# Altium project MCH_MAIN.PrjPcb (part 7 of 7)
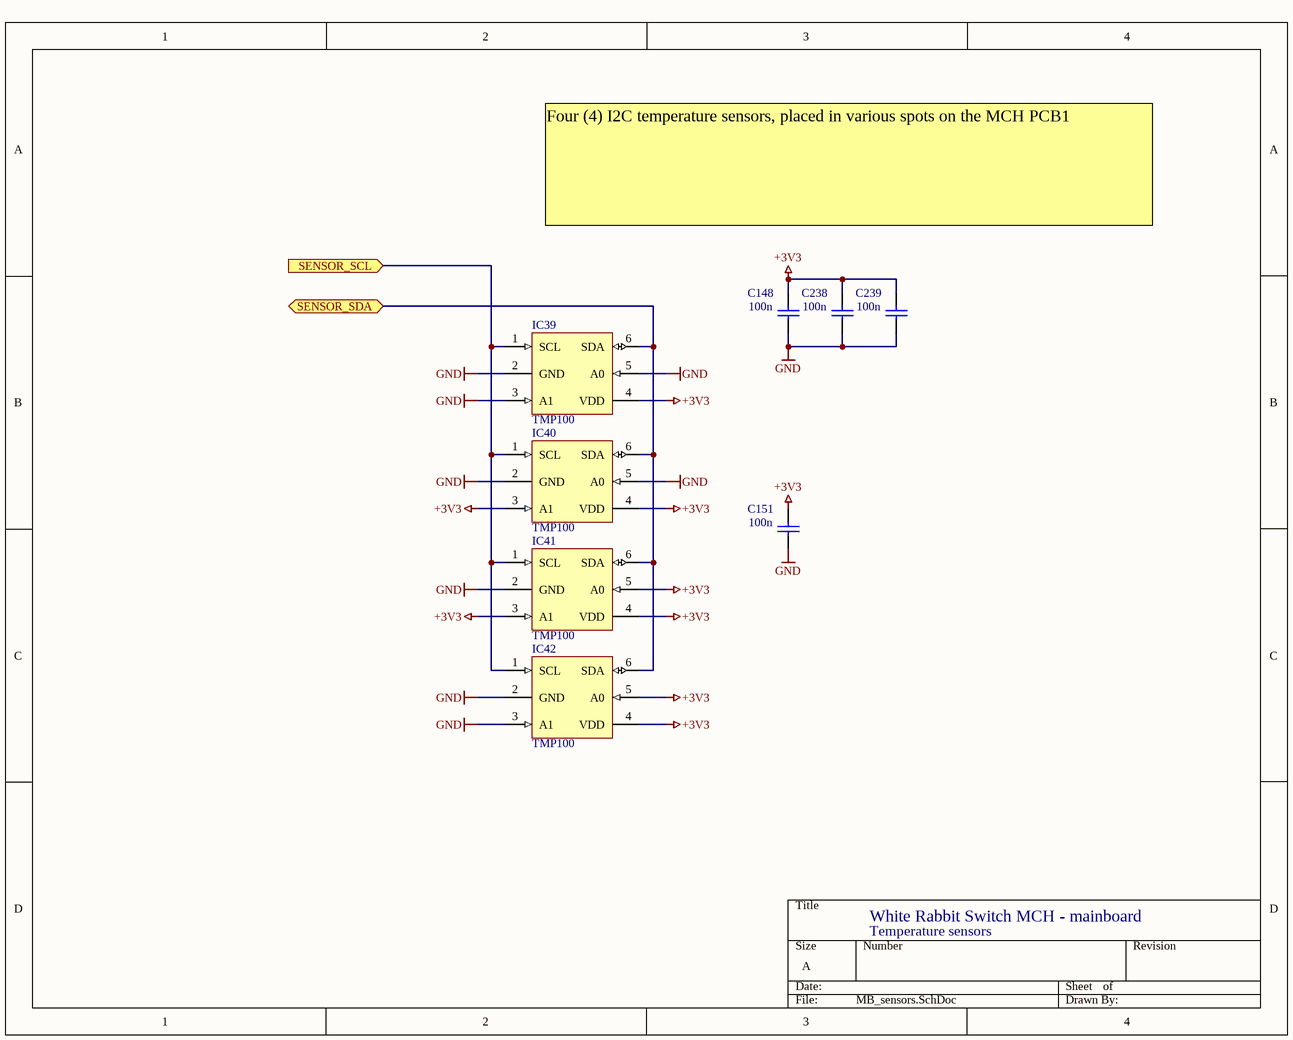
[diagram p20: MB_sensors.SchDoc]

## Nets that join several sheets
+1V2: MB_CPU_io_ports (7 pins), MB_fpga_power (95 pins), MB_power_supply (6 pins), MB_watchdog_mcu (U1.12)
+2V5: MB_main (CN5.9 CN5.10 CN5.11 CN5.12), MB_fpga_power (66 pins), MB_power_supply (17 pins), MB_clocking (IC2.28 IC2.29 L13.2), MB_watchdog_mcu (U1.15)
+2V5_PHY: MB_power_supply (5 pins), DP0 (13 pins), DP1 (13 pins), DP2 (13 pins), DP3 (13 pins), DP4 (13 pins), DP5 (13 pins), DP6 (13 pins), DP7 (13 pins)
+3V3: MB_main (27 pins), MB_CPU_100m_ethernet (18 pins), MB_CPU_io_ports (33 pins), MB_CPU_memory (44 pins), MB_fpga_power (37 pins), MB_power_supply (28 pins), MB_ZBT_memory (28 pins), MB_clocking (C4.2 IC1.8 L14.2), MB_watchdog_mcu (R88.2), MB_sensors (12 pins)
+3V3_MP: MB_main (CN2.4 R75.1), MB_watchdog_mcu (50 pins)
+12V_BACKPLANE: MB_main (8 pins), MB_power_supply (F1.1)
+12V_BULK: MB_main (CN5.1 CN5.2 CN5.3 CN5.4), MB_power_supply (24 pins), MB_watchdog_mcu (R87.2)
ETH100_AGND: MB_main (CN3.8), MB_CPU_100m_ethernet (12 pins)
GND: MB_main (127 pins), MB_CPU_100m_ethernet (18 pins), MB_CPU_io_ports (58 pins), MB_CPU_memory (40 pins), MB_fpga_power (199 pins), MB_power_supply (86 pins), MB_ZBT_memory (27 pins), MB_clocking (16 pins), MB_watchdog_mcu (36 pins), DP0 (14 pins), DP1 (14 pins), DP2 (14 pins), DP3 (14 pins), DP4 (14 pins), DP5 (14 pins), DP6 (14 pins), DP7 (14 pins), MB_sensors (12 pins)
A0: MB_CPU_io_ports (IC5.E9), MB_CPU_memory (IC6.15)
A1: MB_CPU_io_ports (IC5.A9), MB_CPU_memory (IC7.15)
A2: MB_CPU_io_ports (IC5.D9), MB_CPU_memory (IC6.23 IC7.23)
A3: MB_CPU_io_ports (IC5.C9), MB_CPU_memory (IC6.24 IC7.24)
A4: MB_CPU_io_ports (IC5.B9), MB_CPU_memory (IC6.25 IC7.25)
A5: MB_CPU_io_ports (IC5.A8), MB_CPU_memory (IC6.26 IC7.26)
A6: MB_CPU_io_ports (IC5.F9), MB_CPU_memory (IC6.29 IC7.29)
A7: MB_CPU_io_ports (IC5.B8), MB_CPU_memory (IC6.30 IC7.30)
A8: MB_CPU_io_ports (IC5.C8), MB_CPU_memory (IC6.31 IC7.31)
A9: MB_CPU_io_ports (IC5.D8), MB_CPU_memory (IC6.32 IC7.32)
A10: MB_CPU_io_ports (IC5.A7), MB_CPU_memory (IC6.33 IC7.33)
A11: MB_CPU_io_ports (IC5.A6), MB_CPU_memory (IC6.34 IC7.34)
A13: MB_CPU_io_ports (IC5.C7), MB_CPU_memory (IC6.35 IC7.35)
A14: MB_CPU_io_ports (IC5.E7), MB_CPU_memory (IC6.36 IC7.36)
A16: MB_CPU_io_ports (IC5.F7), MB_CPU_memory (IC6.20 IC7.20)
A17: MB_CPU_io_ports (IC5.D6), MB_CPU_memory (IC6.21 IC7.21)
A21: MB_CPU_io_ports (IC5.C6), MB_CPU_memory (IC11.17)
A22: MB_CPU_io_ports (IC5.B6), MB_CPU_memory (IC11.16)
CAS: MB_CPU_io_ports (IC5.B3), MB_CPU_memory (IC6.17 IC7.17)
CLKB_FPGA_DONE: MB_main (CN5.27), MB_CPU_io_ports (IC5.H16)
CLKB_FPGA_nCONF: MB_main (CN5.29), MB_CPU_io_ports (IC5.G15)
CLKB_FPGA_nSTAT: MB_main (CN5.31), MB_CPU_io_ports (IC5.G16)
CLKB_nRST: MB_main (CN4.41), MB_CPU_io_ports (IC5.F15)
CMI_CLKSRC0: MB_main (CN4.19), MB_main_FPGA (IC12.AF26)
CMI_CLKSRC1: MB_main (CN4.17), MB_main_FPGA (IC12.AE25)
CMI_IRQ0: MB_main (CN4.23), MB_main_FPGA (IC12.AF24)
CMI_IRQ1: MB_main (CN4.21), MB_main_FPGA (IC12.AF25)
CMI_PIO0: MB_main (CN4.13), MB_main_FPGA (IC12.AD22)
CMI_PIO1: MB_main (CN4.11), MB_main_FPGA (IC12.AC21)
CMI_PIO2: MB_main (CN4.9), MB_main_FPGA (IC12.AB20)
CMI_PIO3: MB_main (CN4.7), MB_main_FPGA (IC12.AE23)
CMI_SPI_CS: MB_main (CN4.27), MB_main_FPGA (IC12.AE24)
CMI_SPI_SCLK: MB_main (CN4.33), MB_main_FPGA (IC12.AF23)
CMI_SPI_SDIN: MB_main (CN4.31), MB_main_FPGA (IC12.AC22)
CMI_SPI_SDOUT: MB_main (CN4.29), MB_main_FPGA (IC12.AD24)
CONF_DONE: MB_CPU_io_ports (IC5.G18), MB_fpga_power (IC12.P24 R43.2)
CPU_A0: MB_CPU_io_ports (IC5.U6), MB_main_FPGA (IC12.AA24)
CPU_A1: MB_CPU_io_ports (IC5.V5), MB_main_FPGA (IC12.R28)
CPU_A2: MB_CPU_io_ports (IC5.R6), MB_main_FPGA (IC12.J25)
CPU_A3: MB_CPU_io_ports (IC5.V6), MB_main_FPGA (IC12.AA22)
CPU_A4: MB_CPU_io_ports (IC5.P8), MB_main_FPGA (IC12.H24)
CPU_A5: MB_CPU_io_ports (IC5.U7), MB_main_FPGA (IC12.W22)
CPU_A6: MB_CPU_io_ports (IC5.N7), MB_main_FPGA (IC12.M25)
CPU_A7: MB_CPU_io_ports (IC5.T7), MB_main_FPGA (IC12.J24)
CPU_A8: MB_CPU_io_ports (IC5.P7), MB_main_FPGA (IC12.H25)
CPU_A9: MB_CPU_io_ports (IC5.V7), MB_main_FPGA (IC12.AA23)
CPU_A10: MB_CPU_io_ports (IC5.U8), MB_main_FPGA (IC12.U28)
CPU_A11: MB_CPU_io_ports (IC5.N8), MB_main_FPGA (IC12.M26)
CPU_A12: MB_CPU_io_ports (IC5.T8), MB_main_FPGA (IC12.K26)
CPU_A13: MB_CPU_io_ports (IC5.R8), MB_main_FPGA (IC12.L25)
CPU_A14: MB_CPU_io_ports (IC5.R7), MB_main_FPGA (IC12.K25)
CPU_A15: MB_CPU_io_ports (IC5.V8), MB_main_FPGA (IC12.U27)
CPU_A16: MB_CPU_io_ports (IC5.U9), MB_main_FPGA (IC12.V28)
CPU_A17: MB_CPU_io_ports (IC5.R9), MB_main_FPGA (IC12.L24)
CPU_A18: MB_CPU_io_ports (IC5.T9), MB_main_FPGA (IC12.L26)
CPU_A19: MB_CPU_io_ports (IC5.P9), MB_main_FPGA (IC12.G26)
CPU_A20: MB_CPU_io_ports (IC5.V9), MB_main_FPGA (IC12.V27)
CPU_CS: MB_CPU_io_ports (IC5.P10), MB_main_FPGA (IC12.V25)
CPU_D0: MB_CPU_io_ports (IC5.T10), MB_main_FPGA (IC12.P25)
CPU_D1: MB_CPU_io_ports (IC5.R10), MB_main_FPGA (IC12.P26)
CPU_D2: MB_CPU_io_ports (IC5.N10), MB_main_FPGA (IC12.V26)
CPU_D3: MB_CPU_io_ports (IC5.U11), MB_main_FPGA (IC12.AB28)
CPU_D4: MB_CPU_io_ports (IC5.P12), MB_main_FPGA (IC12.W26)
CPU_D5: MB_CPU_io_ports (IC5.V11), MB_main_FPGA (IC12.AA26)
CPU_D6: MB_CPU_io_ports (IC5.N11), MB_main_FPGA (IC12.W25)
CPU_D7: MB_CPU_io_ports (IC5.T11), MB_main_FPGA (IC12.R24)
CPU_D8: MB_CPU_io_ports (IC5.R11), MB_main_FPGA (IC12.R25)
CPU_D9: MB_CPU_io_ports (IC5.N12), MB_main_FPGA (IC12.T25)
CPU_D10: MB_CPU_io_ports (IC5.P13), MB_main_FPGA (IC12.U25)
CPU_D11: MB_CPU_io_ports (IC5.V12), MB_main_FPGA (IC12.AB27)
CPU_D12: MB_CPU_io_ports (IC5.R12), MB_main_FPGA (IC12.T26)
CPU_D13: MB_CPU_io_ports (IC5.U12), MB_main_FPGA (IC12.AC28)
CPU_D14: MB_CPU_io_ports (IC5.T12), MB_main_FPGA (IC12.U24)
CPU_D15: MB_CPU_io_ports (IC5.R13), MB_main_FPGA (IC12.M24)
CPU_D16: MB_CPU_io_ports (IC5.P3), MB_main_FPGA (IC12.P28)
CPU_D17: MB_CPU_io_ports (IC5.U1), MB_main_FPGA (IC12.K27)
CPU_D18: MB_CPU_io_ports (IC5.R3), MB_main_FPGA (IC12.R23)
CPU_D19: MB_CPU_io_ports (IC5.T3), MB_main_FPGA (IC12.P27)
CPU_D20: MB_CPU_io_ports (IC5.U2), MB_main_FPGA (IC12.R22)
CPU_D21: MB_CPU_io_ports (IC5.T4), MB_main_FPGA (IC12.U23)
CPU_D22: MB_CPU_io_ports (IC5.V2), MB_main_FPGA (IC12.K28)
CPU_D23: MB_CPU_io_ports (IC5.U3), MB_main_FPGA (IC12.U22)
CPU_D24: MB_CPU_io_ports (IC5.U4), MB_main_FPGA (IC12.R27)
CPU_D25: MB_CPU_io_ports (IC5.R4), MB_main_FPGA (IC12.L28)
CPU_D26: MB_CPU_io_ports (IC5.T5), MB_main_FPGA (IC12.M28)
CPU_D27: MB_CPU_io_ports (IC5.V3), MB_main_FPGA (IC12.R21)
CPU_D28: MB_CPU_io_ports (IC5.U5), MB_main_FPGA (IC12.V23)
CPU_D29: MB_CPU_io_ports (IC5.V4), MB_main_FPGA (IC12.T22)
CPU_D30: MB_CPU_io_ports (IC5.R5), MB_main_FPGA (IC12.M27)
CPU_D31: MB_CPU_io_ports (IC5.T6), MB_main_FPGA (IC12.L27)
CPU_DMARQ: MB_CPU_io_ports (IC5.J16), MB_main_FPGA (IC12.Y24)
CPU_IRQ0: MB_CPU_io_ports (IC5.K14), MB_main_FPGA (IC12.Y25)
CPU_IRQ1: MB_CPU_io_ports (IC5.A10), MB_main_FPGA (IC12.AA25)
CPU_NBS1: MB_CPU_io_ports (IC5.V10), MB_main_FPGA (IC12.W27)
CPU_NWAIT: MB_CPU_io_ports (IC5.P6), MB_main_FPGA (IC12.H26)
CPU_RD: MB_CPU_io_ports (IC5.U10), MB_main_FPGA (IC12.W28)
CPU_WR: MB_CPU_io_ports (IC5.P11), MB_main_FPGA (IC12.U26)
CUR_SENSE_1V2: MB_power_supply (IC21.6), MB_watchdog_mcu (U1.1)
CUR_SENSE_2V5: MB_power_supply (IC22.6), MB_watchdog_mcu (U1.5)
CUR_SENSE_3V3: MB_power_supply (IC24.6), MB_watchdog_mcu (U1.2)
D0: MB_CPU_io_ports (IC5.C2), MB_CPU_memory (IC6.2 IC11.29)
D1: MB_CPU_io_ports (IC5.D4), MB_CPU_memory (IC6.4 IC11.30)
D2: MB_CPU_io_ports (IC5.A1), MB_CPU_memory (IC6.5 IC11.31)
D3: MB_CPU_io_ports (IC5.D2), MB_CPU_memory (IC6.7 IC11.32)
D4: MB_CPU_io_ports (IC5.B1), MB_CPU_memory (IC6.8 IC11.41)
D5: MB_CPU_io_ports (IC5.E3), MB_CPU_memory (IC6.10 IC11.42)
D6: MB_CPU_io_ports (IC5.C1), MB_CPU_memory (IC6.11 IC11.43)
D7: MB_CPU_io_ports (IC5.E2), MB_CPU_memory (IC6.13 IC11.44)
D8: MB_CPU_io_ports (IC5.E4), MB_CPU_memory (IC6.42)
D9: MB_CPU_io_ports (IC5.F3), MB_CPU_memory (IC6.44)
D10: MB_CPU_io_ports (IC5.D1), MB_CPU_memory (IC6.45)
D11: MB_CPU_io_ports (IC5.F4), MB_CPU_memory (IC6.47)
D12: MB_CPU_io_ports (IC5.F5), MB_CPU_memory (IC6.48)
D13: MB_CPU_io_ports (IC5.F2), MB_CPU_memory (IC6.50)
D14: MB_CPU_io_ports (IC5.G4), MB_CPU_memory (IC6.51)
D15: MB_CPU_io_ports (IC5.E1), MB_CPU_memory (IC6.53)
D16: MB_CPU_io_ports (IC5.H7), MB_CPU_memory (IC7.2)
D17: MB_CPU_io_ports (IC5.G1), MB_CPU_memory (IC7.4)
D18: MB_CPU_io_ports (IC5.J5), MB_CPU_memory (IC7.5)
D19: MB_CPU_io_ports (IC5.J4), MB_CPU_memory (IC7.7)
D20: MB_CPU_io_ports (IC5.J8), MB_CPU_memory (IC7.8)
D21: MB_CPU_io_ports (IC5.J7), MB_CPU_memory (IC7.10)
D22: MB_CPU_io_ports (IC5.J3), MB_CPU_memory (IC7.11)
D23: MB_CPU_io_ports (IC5.J6), MB_CPU_memory (IC7.13)
D24: MB_CPU_io_ports (IC5.H1), MB_CPU_memory (IC7.42)
D25: MB_CPU_io_ports (IC5.K8), MB_CPU_memory (IC7.44)
D26: MB_CPU_io_ports (IC5.J2), MB_CPU_memory (IC7.45)
D27: MB_CPU_io_ports (IC5.K5), MB_CPU_memory (IC7.47)
D28: MB_CPU_io_ports (IC5.K2), MB_CPU_memory (IC7.48)
D29: MB_CPU_io_ports (IC5.K7), MB_CPU_memory (IC7.50)
D30: MB_CPU_io_ports (IC5.J1), MB_CPU_memory (IC7.51)
D31: MB_CPU_io_ports (IC5.K6), MB_CPU_memory (IC7.53)
DBG_RXD: MB_main (CN8.4), MB_CPU_io_ports (IC5.A11)
DBG_TXD: MB_main (CN8.6), MB_CPU_io_ports (IC5.E10)
DCLK: MB_main (R69.1 R109.1), MB_fpga_power (IC12.P3)
DMTDCLK_MAIN+: MB_main (CN11.9), MB_main_FPGA (IC12.AG14 R101.2)
DMTDCLK_MAIN-: MB_main (CN11.11), MB_main_FPGA (IC12.AH14 R101.1)
DP0_RD0: MB_main_FPGA (IC12.W8), DP0 (IC23_DP0.29)
DP0_RD1: MB_main_FPGA (IC12.Y7), DP0 (IC23_DP0.28)
DP0_RD2: MB_main_FPGA (IC12.AA5), DP0 (IC23_DP0.27)
DP0_RD3: MB_main_FPGA (IC12.AA6), DP0 (IC23_DP0.25)
DP0_RD4: MB_main_FPGA (IC12.AB7), DP0 (IC23_DP0.24)
DP0_RD5: MB_main_FPGA (IC12.AB6), DP0 (IC23_DP0.23)
DP0_RD6: MB_main_FPGA (IC12.AB5), DP0 (IC23_DP0.22)
DP0_RD7: MB_main_FPGA (IC12.AC8), DP0 (IC23_DP0.21)
DP0_RD8: MB_main_FPGA (IC12.AC7), DP0 (IC23_DP0.20)
DP0_RD9: MB_main_FPGA (IC12.AD8), DP0 (IC23_DP0.19)
DP0_TD0: MB_main_FPGA (IC12.AE7), DP0 (IC23_DP0.2)
DP0_TD1: MB_main_FPGA (IC12.AF8), DP0 (IC23_DP0.3)
DP0_TD2: MB_main_FPGA (IC12.AE8), DP0 (IC23_DP0.4)
DP0_TD3: MB_main_FPGA (IC12.AD7), DP0 (IC23_DP0.5)
DP0_TD4: MB_main_FPGA (IC12.AD5), DP0 (IC23_DP0.7)
DP0_TD5: MB_main_FPGA (IC12.AF6), DP0 (IC23_DP0.8)
DP0_TD6: MB_main_FPGA (IC12.AC12), DP0 (IC23_DP0.9)
DP0_TD7: MB_main_FPGA (IC12.AE6), DP0 (IC23_DP0.10)
DP0_TD8: MB_main_FPGA (IC12.AC10), DP0 (IC23_DP0.11)
DP0_TD9: MB_main_FPGA (IC12.AB9), DP0 (IC23_DP0.12)
DP1_RD0: MB_main_FPGA (IC12.N3), DP1 (IC23_DP1.29)
DP1_RD1: MB_main_FPGA (IC12.M3), DP1 (IC23_DP1.28)
DP1_RD2: MB_main_FPGA (IC12.N4), DP1 (IC23_DP1.27)
DP1_RD3: MB_main_FPGA (IC12.K8), DP1 (IC23_DP1.25)
DP1_RD4: MB_main_FPGA (IC12.U3), DP1 (IC23_DP1.24)
DP1_RD5: MB_main_FPGA (IC12.L6), DP1 (IC23_DP1.23)
DP1_RD6: MB_main_FPGA (IC12.M5), DP1 (IC23_DP1.22)
DP1_RD7: MB_main_FPGA (IC12.M7), DP1 (IC23_DP1.21)
DP1_RD8: MB_main_FPGA (IC12.M8), DP1 (IC23_DP1.20)
DP1_RD9: MB_main_FPGA (IC12.N8), DP1 (IC23_DP1.19)
DP1_TD0: MB_main_FPGA (IC12.AA4), DP1 (IC23_DP1.2)
DP1_TD1: MB_main_FPGA (IC12.V4), DP1 (IC23_DP1.3)
DP1_TD2: MB_main_FPGA (IC12.V8), DP1 (IC23_DP1.4)
DP1_TD3: MB_main_FPGA (IC12.U7), DP1 (IC23_DP1.5)
DP1_TD4: MB_main_FPGA (IC12.U8), DP1 (IC23_DP1.7)
DP1_TD5: MB_main_FPGA (IC12.Y3), DP1 (IC23_DP1.8)
DP1_TD6: MB_main_FPGA (IC12.Y4), DP1 (IC23_DP1.9)
DP1_TD7: MB_main_FPGA (IC12.AB3), DP1 (IC23_DP1.10)
DP1_TD8: MB_main_FPGA (IC12.T7), DP1 (IC23_DP1.11)
DP1_TD9: MB_main_FPGA (IC12.R7), DP1 (IC23_DP1.12)
DP2_RD0: MB_main_FPGA (IC12.AD4), DP2 (IC23_DP2.29)
DP2_RD1: MB_main_FPGA (IC12.AC3), DP2 (IC23_DP2.28)
DP2_RD2: MB_main_FPGA (IC12.AB4), DP2 (IC23_DP2.27)
DP2_RD3: MB_main_FPGA (IC12.AG8), DP2 (IC23_DP2.25)
DP2_RD4: MB_main_FPGA (IC12.AH8), DP2 (IC23_DP2.24)
DP2_RD5: MB_main_FPGA (IC12.AG10), DP2 (IC23_DP2.23)
DP2_RD6: MB_main_FPGA (IC12.AH10), DP2 (IC23_DP2.22)
DP2_RD7: MB_main_FPGA (IC12.AG11), DP2 (IC23_DP2.21)
DP2_RD8: MB_main_FPGA (IC12.AH11), DP2 (IC23_DP2.20)
DP2_RD9: MB_main_FPGA (IC12.AE3), DP2 (IC23_DP2.19)
DP2_TD0: MB_main_FPGA (IC12.AD11), DP2 (IC23_DP2.2)
DP2_TD1: MB_main_FPGA (IC12.AE10), DP2 (IC23_DP2.3)
DP2_TD2: MB_main_FPGA (IC12.AF10), DP2 (IC23_DP2.4)
DP2_TD3: MB_main_FPGA (IC12.AE9), DP2 (IC23_DP2.5)
DP2_TD4: MB_main_FPGA (IC12.AF9), DP2 (IC23_DP2.7)
DP2_TD5: MB_main_FPGA (IC12.AD10), DP2 (IC23_DP2.8)
DP2_TD6: MB_main_FPGA (IC12.AF5), DP2 (IC23_DP2.9)
DP2_TD7: MB_main_FPGA (IC12.AC11), DP2 (IC23_DP2.10)
DP2_TD8: MB_main_FPGA (IC12.AB10), DP2 (IC23_DP2.11)
DP2_TD9: MB_main_FPGA (IC12.AH12), DP2 (IC23_DP2.12)
DP3_RD0: MB_main_FPGA (IC12.E2), DP3 (IC23_DP3.29)
DP3_RD1: MB_main_FPGA (IC12.D1), DP3 (IC23_DP3.28)
DP3_RD2: MB_main_FPGA (IC12.C3), DP3 (IC23_DP3.27)
DP3_RD3: MB_main_FPGA (IC12.F2), DP3 (IC23_DP3.25)
DP3_RD4: MB_main_FPGA (IC12.L2), DP3 (IC23_DP3.24)
DP3_RD5: MB_main_FPGA (IC12.L1), DP3 (IC23_DP3.23)
DP3_RD6: MB_main_FPGA (IC12.M2), DP3 (IC23_DP3.22)
DP3_RD7: MB_main_FPGA (IC12.M1), DP3 (IC23_DP3.21)
DP3_RD8: MB_main_FPGA (IC12.P2), DP3 (IC23_DP3.20)
DP3_RD9: MB_main_FPGA (IC12.P1), DP3 (IC23_DP3.19)
DP3_TD0: MB_main_FPGA (IC12.H5), DP3 (IC23_DP3.2)
DP3_TD1: MB_main_FPGA (IC12.H7), DP3 (IC23_DP3.3)
DP3_TD2: MB_main_FPGA (IC12.H6), DP3 (IC23_DP3.4)
DP3_TD3: MB_main_FPGA (IC12.D8), DP3 (IC23_DP3.5)
DP3_TD4: MB_main_FPGA (IC12.C7), DP3 (IC23_DP3.7)
DP3_TD5: MB_main_FPGA (IC12.C8), DP3 (IC23_DP3.8)
DP3_TD6: MB_main_FPGA (IC12.D2), DP3 (IC23_DP3.9)
DP3_TD7: MB_main_FPGA (IC12.E8), DP3 (IC23_DP3.10)
DP3_TD8: MB_main_FPGA (IC12.C2), DP3 (IC23_DP3.11)
DP3_TD9: MB_main_FPGA (IC12.D3), DP3 (IC23_DP3.12)
DP4_RD0: MB_main_FPGA (IC12.T3), DP4 (IC23_DP4.29)
DP4_RD1: MB_main_FPGA (IC12.T4), DP4 (IC23_DP4.28)
DP4_RD2: MB_main_FPGA (IC12.R3), DP4 (IC23_DP4.27)
DP4_RD3: MB_main_FPGA (IC12.R4), DP4 (IC23_DP4.25)
DP4_RD4: MB_main_FPGA (IC12.AD2), DP4 (IC23_DP4.24)
DP4_RD5: MB_main_FPGA (IC12.AD1), DP4 (IC23_DP4.23)
DP4_RD6: MB_main_FPGA (IC12.AE2), DP4 (IC23_DP4.22)
DP4_RD7: MB_main_FPGA (IC12.AE1), DP4 (IC23_DP4.21)
DP4_RD8: MB_main_FPGA (IC12.AF2), DP4 (IC23_DP4.20)
DP4_RD9: MB_main_FPGA (IC12.U6), DP4 (IC23_DP4.19)
DP4_TD0: MB_main_FPGA (IC12.V6), DP4 (IC23_DP4.2)
DP4_TD1: MB_main_FPGA (IC12.W4), DP4 (IC23_DP4.3)
DP4_TD2: MB_main_FPGA (IC12.Y5), DP4 (IC23_DP4.4)
DP4_TD3: MB_main_FPGA (IC12.AH7), DP4 (IC23_DP4.5)
DP4_TD4: MB_main_FPGA (IC12.AG7), DP4 (IC23_DP4.7)
DP4_TD5: MB_main_FPGA (IC12.AH6), DP4 (IC23_DP4.8)
DP4_TD6: MB_main_FPGA (IC12.AG6), DP4 (IC23_DP4.9)
DP4_TD7: MB_main_FPGA (IC12.AH4), DP4 (IC23_DP4.10)
DP4_TD8: MB_main_FPGA (IC12.AG4), DP4 (IC23_DP4.11)
DP4_TD9: MB_main_FPGA (IC12.AH3), DP4 (IC23_DP4.12)
DP5_RD0: MB_main_FPGA (IC12.E12), DP5 (IC23_DP5.29)
DP5_RD1: MB_main_FPGA (IC12.F11), DP5 (IC23_DP5.28)
DP5_RD2: MB_main_FPGA (IC12.F7), DP5 (IC23_DP5.27)
DP5_RD3: MB_main_FPGA (IC12.F10), DP5 (IC23_DP5.25)
DP5_RD4: MB_main_FPGA (IC12.F8), DP5 (IC23_DP5.24)
DP5_RD5: MB_main_FPGA (IC12.G9), DP5 (IC23_DP5.23)
DP5_RD6: MB_main_FPGA (IC12.C5), DP5 (IC23_DP5.22)
DP5_RD7: MB_main_FPGA (IC12.G8), DP5 (IC23_DP5.21)
DP5_RD8: MB_main_FPGA (IC12.G7), DP5 (IC23_DP5.20)
DP5_RD9: MB_main_FPGA (IC12.G6), DP5 (IC23_DP5.19)
DP5_TD0: MB_main_FPGA (IC12.C6), DP5 (IC23_DP5.2)
DP5_TD1: MB_main_FPGA (IC12.D4), DP5 (IC23_DP5.3)
DP5_TD2: MB_main_FPGA (IC12.C4), DP5 (IC23_DP5.4)
DP5_TD3: MB_main_FPGA (IC12.K1), DP5 (IC23_DP5.5)
DP5_TD4: MB_main_FPGA (IC12.K2), DP5 (IC23_DP5.7)
DP5_TD5: MB_main_FPGA (IC12.G2), DP5 (IC23_DP5.8)
DP5_TD6: MB_main_FPGA (IC12.E5), DP5 (IC23_DP5.9)
DP5_TD7: MB_main_FPGA (IC12.D7), DP5 (IC23_DP5.10)
DP5_TD8: MB_main_FPGA (IC12.G1), DP5 (IC23_DP5.11)
DP5_TD9: MB_main_FPGA (IC12.D5), DP5 (IC23_DP5.12)
DP6_RD0: MB_main_FPGA (IC12.H4), DP6 (IC23_DP6.29)
DP6_RD1: MB_main_FPGA (IC12.F3), DP6 (IC23_DP6.28)
DP6_RD2: MB_main_FPGA (IC12.F4), DP6 (IC23_DP6.27)
DP6_RD3: MB_main_FPGA (IC12.R2), DP6 (IC23_DP6.25)
DP6_RD4: MB_main_FPGA (IC12.K3), DP6 (IC23_DP6.24)
DP6_RD5: MB_main_FPGA (IC12.K4), DP6 (IC23_DP6.23)
DP6_RD6: MB_main_FPGA (IC12.R1), DP6 (IC23_DP6.22)
DP6_RD7: MB_main_FPGA (IC12.H3), DP6 (IC23_DP6.21)
DP6_RD8: MB_main_FPGA (IC12.J5), DP6 (IC23_DP6.20)
DP6_RD9: MB_main_FPGA (IC12.J4), DP6 (IC23_DP6.19)
DP6_TD0: MB_main_FPGA (IC12.L5), DP6 (IC23_DP6.2)
DP6_TD1: MB_main_FPGA (IC12.AC1), DP6 (IC23_DP6.3)
DP6_TD2: MB_main_FPGA (IC12.AC2), DP6 (IC23_DP6.4)
DP6_TD3: MB_main_FPGA (IC12.AB1), DP6 (IC23_DP6.5)
DP6_TD4: MB_main_FPGA (IC12.AB2), DP6 (IC23_DP6.7)
DP6_TD5: MB_main_FPGA (IC12.W1), DP6 (IC23_DP6.8)
DP6_TD6: MB_main_FPGA (IC12.W2), DP6 (IC23_DP6.9)
DP6_TD7: MB_main_FPGA (IC12.V1), DP6 (IC23_DP6.10)
DP6_TD8: MB_main_FPGA (IC12.V2), DP6 (IC23_DP6.11)
DP6_TD9: MB_main_FPGA (IC12.U1), DP6 (IC23_DP6.12)
DP7_RD0: MB_main_FPGA (IC12.A11), DP7 (IC23_DP7.29)
DP7_RD1: MB_main_FPGA (IC12.B10), DP7 (IC23_DP7.28)
DP7_RD2: MB_main_FPGA (IC12.A10), DP7 (IC23_DP7.27)
DP7_RD3: MB_main_FPGA (IC12.C10), DP7 (IC23_DP7.25)
DP7_RD4: MB_main_FPGA (IC12.A8), DP7 (IC23_DP7.24)
DP7_RD5: MB_main_FPGA (IC12.B8), DP7 (IC23_DP7.23)
DP7_RD6: MB_main_FPGA (IC12.A7), DP7 (IC23_DP7.22)
DP7_RD7: MB_main_FPGA (IC12.B7), DP7 (IC23_DP7.21)
DP7_RD8: MB_main_FPGA (IC12.A6), DP7 (IC23_DP7.20)
DP7_RD9: MB_main_FPGA (IC12.B6), DP7 (IC23_DP7.19)
DP7_TD0: MB_main_FPGA (IC12.C13), DP7 (IC23_DP7.2)
DP7_TD1: MB_main_FPGA (IC12.D13), DP7 (IC23_DP7.3)
DP7_TD2: MB_main_FPGA (IC12.D9), DP7 (IC23_DP7.4)
DP7_TD3: MB_main_FPGA (IC12.E14), DP7 (IC23_DP7.5)
DP7_TD4: MB_main_FPGA (IC12.E11), DP7 (IC23_DP7.7)
DP7_TD5: MB_main_FPGA (IC12.D10), DP7 (IC23_DP7.8)
DP7_TD6: MB_main_FPGA (IC12.C9), DP7 (IC23_DP7.9)
DP7_TD7: MB_main_FPGA (IC12.E10), DP7 (IC23_DP7.10)
DP7_TD8: MB_main_FPGA (IC12.D12), DP7 (IC23_DP7.11)
DP7_TD9: MB_main_FPGA (IC12.D11), DP7 (IC23_DP7.12)
DP_ENABLE0: MB_main_FPGA (IC12.AF7), DP0 (IC23_DP0.1)
DP_ENABLE1: MB_main_FPGA (IC12.AA3), DP1 (IC23_DP1.1)
DP_ENABLE2: MB_main_FPGA (IC12.AF11), DP2 (IC23_DP2.1)
DP_ENABLE3: MB_main_FPGA (IC12.F5), DP3 (IC23_DP3.1)
DP_ENABLE4: MB_main_FPGA (IC12.V3), DP4 (IC23_DP4.1)
DP_ENABLE5: MB_main_FPGA (IC12.B3), DP5 (IC23_DP5.1)
DP_ENABLE6: MB_main_FPGA (IC12.L4), DP6 (IC23_DP6.1)
DP_ENABLE7: MB_main_FPGA (IC12.D14), DP7 (IC23_DP7.1)
DP_LOOPEN0: MB_main_FPGA (IC12.AB8), DP0 (IC23_DP0.15)
DP_LOOPEN1: MB_main_FPGA (IC12.T8), DP1 (IC23_DP1.15)
DP_LOOPEN2: MB_main_FPGA (IC12.AG12), DP2 (IC23_DP2.15)
DP_LOOPEN3: MB_main_FPGA (IC12.E3), DP3 (IC23_DP3.15)
DP_LOOPEN4: MB_main_FPGA (IC12.AG3), DP4 (IC23_DP4.15)
DP_LOOPEN5: MB_main_FPGA (IC12.D6), DP5 (IC23_DP5.15)
DP_LOOPEN6: MB_main_FPGA (IC12.U2), DP6 (IC23_DP6.15)
DP_LOOPEN7: MB_main_FPGA (IC12.C12), DP7 (IC23_DP7.15)
DP_PRBSEN0: MB_main_FPGA (IC12.V7), DP0 (IC23_DP0.31)
DP_PRBSEN1: MB_main_FPGA (IC12.K7), DP1 (IC23_DP1.31)
DP_PRBSEN2: MB_main_FPGA (IC12.AC4), DP2 (IC23_DP2.31)
DP_PRBSEN3: MB_main_FPGA (IC12.E4), DP3 (IC23_DP3.31)
DP_PRBSEN4: MB_main_FPGA (IC12.U4), DP4 (IC23_DP4.31)
DP_PRBSEN5: MB_main_FPGA (IC12.G13), DP5 (IC23_DP5.31)
DP_PRBSEN6: MB_main_FPGA (IC12.G4), DP6 (IC23_DP6.31)
DP_PRBSEN7: MB_main_FPGA (IC12.A12), DP7 (IC23_DP7.31)
DP_SYNC_PASS0: MB_main_FPGA (IC12.Y6), DP0 (IC23_DP0.30)
DP_SYNC_PASS1: MB_main_FPGA (IC12.J6), DP1 (IC23_DP1.30)
DP_SYNC_PASS2: MB_main_FPGA (IC12.AC5), DP2 (IC23_DP2.30)
DP_SYNC_PASS3: MB_main_FPGA (IC12.F1), DP3 (IC23_DP3.30)
DP_SYNC_PASS4: MB_main_FPGA (IC12.R5), DP4 (IC23_DP4.30)
DP_SYNC_PASS5: MB_main_FPGA (IC12.G12), DP5 (IC23_DP5.30)
DP_SYNC_PASS6: MB_main_FPGA (IC12.G5), DP6 (IC23_DP6.30)
DP_SYNC_PASS7: MB_main_FPGA (IC12.B11), DP7 (IC23_DP7.30)
DP_SYNCEN0: MB_main_FPGA (IC12.W7), DP0 (IC23_DP0.32)
DP_SYNCEN1: MB_main_FPGA (IC12.J7), DP1 (IC23_DP1.32)
DP_SYNCEN2: MB_main_FPGA (IC12.AD3), DP2 (IC23_DP2.32)
DP_SYNCEN3: MB_main_FPGA (IC12.E1), DP3 (IC23_DP3.32)
DP_SYNCEN4: MB_main_FPGA (IC12.R6), DP4 (IC23_DP4.32)
DP_SYNCEN5: MB_main_FPGA (IC12.F12), DP5 (IC23_DP5.32)
DP_SYNCEN6: MB_main_FPGA (IC12.G3), DP6 (IC23_DP6.32)
DP_SYNCEN7: MB_main_FPGA (IC12.B12), DP7 (IC23_DP7.32)
FBOOT_SEL: MB_CPU_memory (IC8.1), MB_watchdog_mcu (IC9#2.F6)
fclkin_2v5_1: MB_main_FPGA (IC12.AG15), DP0 (R20_DP0.2)
fclkin_2v5_2: MB_main_FPGA (IC12.AH15), DP1 (R20_DP1.2)
fclkin_2v5_3: MB_main_FPGA (IC12.Y1), DP2 (R20_DP2.2)
fclkin_2v5_4: MB_main_FPGA (IC12.A14), DP3 (R20_DP3.2)
fclkin_2v5_5: MB_main_FPGA (IC12.B14), DP5 (R20_DP5.2)
fclkin_2v5_6: MB_main_FPGA (IC12.J1), DP7 (R20_DP7.2)
fclkin_2v5_7: MB_main_FPGA (IC12.J2), DP6 (R20_DP6.2)
fclkin_2v5_8: MB_main_FPGA (IC12.Y2), DP4 (R20_DP4.2)
fclkin_3v3_1: MB_main_FPGA (IC12.J28), MB_clocking (R11.2)
fclkin_3v3_2: MB_main (R73.1), MB_main_FPGA (IC12.J27)
fclkin_3v3_3: MB_main (CN11.14), MB_main_FPGA (IC12.Y27)
fclkin_3v3_4: MB_main (CN11.10), MB_main_FPGA (IC12.Y28)
FMAIN_SEL: MB_CPU_memory (IC9#1.1), MB_watchdog_mcu (IC9#2.H6)
FP_FPGALEDA0: MB_main (RP8.8), MB_main_FPGA (IC12.G24)
FP_FPGALEDA1: MB_main (RP8.6), MB_main_FPGA (IC12.K22)
FP_FPGALEDA2: MB_main (RP9.8), MB_main_FPGA (IC12.H23)
FP_FPGALEDA3: MB_main (RP9.6), MB_main_FPGA (IC12.M21)
FP_FPGALEDB0: MB_main (RP8.7), MB_main_FPGA (IC12.L23)
FP_FPGALEDB1: MB_main (RP8.5), MB_main_FPGA (IC12.J23)
FP_FPGALEDB2: MB_main (RP9.7), MB_main_FPGA (IC12.M23)
FP_FPGALEDB3: MB_main (RP9.5), MB_main_FPGA (IC12.K21)
FP_GPLEDA0: MB_main (RP6.8), MB_CPU_io_ports (IC5.B16)
FP_GPLEDA1: MB_main (RP6.6), MB_CPU_io_ports (IC5.B15)
FP_GPLEDA2: MB_main (RP7.8), MB_CPU_io_ports (IC5.B14)
FP_GPLEDA3: MB_main (RP7.6), MB_CPU_io_ports (IC5.C13)
FP_GPLEDB0: MB_main (RP6.7), MB_CPU_io_ports (IC5.A15)
FP_GPLEDB1: MB_main (RP6.5), MB_CPU_io_ports (IC5.A14)
FP_GPLEDB2: MB_main (RP7.7), MB_CPU_io_ports (IC5.B13)
FP_GPLEDB3: MB_main (RP7.5), MB_CPU_io_ports (IC5.D13)
FP_UTCA_HSWAPSW: MB_main (R75.2 S1.B S1.D), MB_CPU_io_ports (IC5.D17), MB_watchdog_mcu (IC9#2.H9)
FP_UTCA_LED0: MB_main (RP5.8), MB_CPU_io_ports (IC5.E13), MB_watchdog_mcu (IC9#2.J2)
FP_UTCA_LED1: MB_main (RP5.7), MB_CPU_io_ports (IC5.E12), MB_watchdog_mcu (IC9#2.F4)
FP_UTCA_LED2: MB_main (RP5.6), MB_CPU_io_ports (IC5.F12)
FP_UTCA_LED3: MB_main (RP5.5), MB_CPU_io_ports (IC5.F13)
FRU_SCL: MB_main (CN2.130), MB_watchdog_mcu (IC9#2.A3 RP24.8)
FRU_SDA: MB_main (CN2.129), MB_watchdog_mcu (IC9#2.B4 RP24.7)
IMCH_UPD_RX: MB_main (IC20.5), MB_main_FPGA (IC12.W21)
IMCH_UPD_TX: MB_main (IC19.5), MB_main_FPGA (IC12.Y22)
InRST: MB_CPU_io_ports (IC5.G14), MB_main_FPGA (IC12.V24)
INTER_SCL: MB_main (CN2.56), MB_watchdog_mcu (IC9#2.D10 RP24.5)
INTER_SDA: MB_main (CN2.71), MB_watchdog_mcu (IC9#2.D7 RP24.6)
IPMB0_A_SCL: MB_main (CN2.127), MB_watchdog_mcu (IC9#2.A4 RP22.8)
IPMB0_A_SDA: MB_main (CN2.126), MB_watchdog_mcu (IC9#2.B5 RP22.7)
IPMB0_B_SCL: MB_main (CN2.124), MB_watchdog_mcu (IC9#2.A5 RP22.6)
IPMB0_B_SDA: MB_main (CN2.123), MB_watchdog_mcu (IC9#2.C3 RP22.5)
IPMBL_SCL0: MB_main (CN2.121), MB_watchdog_mcu (IC9#2.C4 RP19.8)
IPMBL_SCL1: MB_main (CN2.118), MB_watchdog_mcu (IC9#2.E4 RP19.6)
IPMBL_SCL2: MB_main (CN2.115), MB_watchdog_mcu (IC9#2.D5 RP21.8)
IPMBL_SCL3: MB_main (CN2.112), MB_watchdog_mcu (IC9#2.D6 RP21.6)
IPMBL_SCL4: MB_main (CN2.109), MB_watchdog_mcu (IC9#2.C8 RP23.8)
IPMBL_SCL5: MB_main (CN2.106), MB_watchdog_mcu (IC9#2.A6 RP23.6)
IPMBL_SCL6: MB_main (CN2.103), MB_watchdog_mcu (IC9#2.A7 RP25.8)
IPMBL_SCL7: MB_main (CN2.100), MB_watchdog_mcu (IC9#2.A8 RP25.6)
IPMBL_SDA0: MB_main (CN2.120), MB_watchdog_mcu (IC9#2.E3 RP19.7)
IPMBL_SDA1: MB_main (CN2.117), MB_watchdog_mcu (IC9#2.C5 RP19.5)
IPMBL_SDA2: MB_main (CN2.114), MB_watchdog_mcu (IC9#2.C6 RP21.7)
IPMBL_SDA3: MB_main (CN2.111), MB_watchdog_mcu (IC9#2.C7 RP21.5)
IPMBL_SDA4: MB_main (CN2.108), MB_watchdog_mcu (IC9#2.B6 RP23.7)
IPMBL_SDA5: MB_main (CN2.105), MB_watchdog_mcu (IC9#2.B7 RP23.5)
IPMBL_SDA6: MB_main (CN2.102), MB_watchdog_mcu (IC9#2.B8 RP25.7)
IPMBL_SDA7: MB_main (CN2.99), MB_watchdog_mcu (IC9#2.C10 RP25.5)
IPPS_IN: MB_main (CN5.35), MB_main_FPGA (IC12.AC27)
IPPS_OUT: MB_main (CN5.37), MB_main_FPGA (IC12.AD27)
ISMI_RX0: MB_main (CN6.5), MB_main_FPGA (IC12.F17)
ISMI_RX1: MB_main (CN6.9), MB_main_FPGA (IC12.F18)
ISMI_RX2: MB_main (CN6.15), MB_main_FPGA (IC12.G18)
ISMI_RX3: MB_main (CN6.19), MB_main_FPGA (IC12.E19)
ISMI_RX4: MB_main (CN6.6), MB_main_FPGA (IC12.F21)
ISMI_RX5: MB_main (CN6.10), MB_main_FPGA (IC12.G20)
ISMI_RX6: MB_main (CN6.16), MB_main_FPGA (IC12.G19)
ISMI_RX7: MB_main (CN6.20), MB_main_FPGA (IC12.F19)
ISMI_TX0: MB_main (RP28.4), MB_main_FPGA (IC12.H15)
ISMI_TX1: MB_main (RP28.3), MB_main_FPGA (IC12.J16)
ISMI_TX2: MB_main (RP28.2), MB_main_FPGA (IC12.J17)
ISMI_TX3: MB_main (RP28.1), MB_main_FPGA (IC12.J15)
ISMI_TX4: MB_main (RP29.8), MB_main_FPGA (IC12.H17)
ISMI_TX5: MB_main (RP29.7), MB_main_FPGA (IC12.G17)
ISMI_TX6: MB_main (RP29.6), MB_main_FPGA (IC12.G16)
ISMI_TX7: MB_main (RP29.5), MB_main_FPGA (IC12.H16)
IUP0_RD0: MB_main (CN4.26), MB_main_FPGA (IC12.AB19)
IUP0_RD1: MB_main (CN4.28), MB_main_FPGA (IC12.AC19)
IUP0_RD2: MB_main (CN4.30), MB_main_FPGA (IC12.AC18)
IUP0_RD3: MB_main (CN4.32), MB_main_FPGA (IC12.AC17)
IUP0_RD4: MB_main (CN4.34), MB_main_FPGA (IC12.AB16)
IUP0_RD5: MB_main (CN4.38), MB_main_FPGA (IC12.AE21)
IUP0_RD6: MB_main (CN4.40), MB_main_FPGA (IC12.AF21)
IUP0_RD7: MB_main (CN4.42), MB_main_FPGA (IC12.AF22)
IUP0_RD8: MB_main (CN4.44), MB_main_FPGA (IC12.AE20)
IUP0_RD9: MB_main (CN4.46), MB_main_FPGA (IC12.AF20)
IUP1_RD0: MB_main (CN4.2), MB_main_FPGA (IC12.AG26)
IUP1_RD1: MB_main (CN4.4), MB_main_FPGA (IC12.AH26)
IUP1_RD2: MB_main (CN4.6), MB_main_FPGA (IC12.AF19)
IUP1_RD3: MB_main (CN4.8), MB_main_FPGA (IC12.AE19)
IUP1_RD4: MB_main (CN4.10), MB_main_FPGA (IC12.AD21)
IUP1_RD5: MB_main (CN4.14), MB_main_FPGA (IC12.AD19)
IUP1_RD6: MB_main (CN4.16), MB_main_FPGA (IC12.AF18)
IUP1_RD7: MB_main (CN4.18), MB_main_FPGA (IC12.AE18)
IUP1_RD8: MB_main (CN4.20), MB_main_FPGA (IC12.AD18)
IUP1_RD9: MB_main (CN4.22), MB_main_FPGA (IC12.AF17)
IUP_SFP_DETECT0: MB_main (CN5.30), MB_main_FPGA (IC12.AB26)
IUP_SFP_DETECT1: MB_main (CN5.16), MB_main_FPGA (IC12.AC24)
IUP_SFP_LOS0: MB_main (CN5.28), MB_main_FPGA (IC12.AB24)
IUP_SFP_LOS1: MB_main (CN5.14), MB_main_FPGA (IC12.AE26)
IUP_SFP_TX_FAULT0: MB_main (CN5.32), MB_main_FPGA (IC12.AB25)
IUP_SFP_TX_FAULT1: MB_main (CN5.18), MB_main_FPGA (IC12.AD26)
IUP_SYNC_PASS0: MB_main (CN11.50), MB_main_FPGA (IC12.AE17)
IUP_SYNC_PASS1: MB_main (CN11.44), MB_main_FPGA (IC12.AE15)
IWD_IN: MB_main (CN4.3), MB_main_FPGA (IC12.G21), MB_watchdog_mcu (IC9#2.G5)
IWD_OUT: MB_main_FPGA (IC12.F22), MB_watchdog_mcu (IC9#2.H4)
IZBT_A0: MB_main_FPGA (IC12.G25), MB_ZBT_memory (IC17.37)
IZBT_A1: MB_main_FPGA (IC12.G27), MB_ZBT_memory (IC17.36)
IZBT_A2: MB_main_FPGA (IC12.G28), MB_ZBT_memory (IC17.35)
IZBT_A3: MB_main_FPGA (IC12.E28), MB_ZBT_memory (IC17.34)
IZBT_A4: MB_main_FPGA (IC12.E27), MB_ZBT_memory (IC17.33)
IZBT_A5: MB_main_FPGA (IC12.F28), MB_ZBT_memory (IC17.32)
IZBT_A6: MB_main_FPGA (IC12.F15), MB_ZBT_memory (IC17.100)
IZBT_A7: MB_main_FPGA (IC12.E15), MB_ZBT_memory (IC17.99)
IZBT_A8: MB_main_FPGA (IC12.D18), MB_ZBT_memory (IC17.82)
IZBT_A9: MB_main_FPGA (IC12.E18), MB_ZBT_memory (IC17.81)
IZBT_A10: MB_main_FPGA (IC12.F26), MB_ZBT_memory (IC17.44)
IZBT_A11: MB_main_FPGA (IC12.E26), MB_ZBT_memory (IC17.45)
IZBT_A12: MB_main_FPGA (IC12.F25), MB_ZBT_memory (IC17.46)
IZBT_A13: MB_main_FPGA (IC12.E25), MB_ZBT_memory (IC17.47)
IZBT_A14: MB_main_FPGA (IC12.F24), MB_ZBT_memory (IC17.48)
IZBT_A15: MB_main_FPGA (IC12.D26), MB_ZBT_memory (IC17.49)
IZBT_A16: MB_main_FPGA (IC12.C26), MB_ZBT_memory (IC17.50)
IZBT_ADV/LD: MB_main_FPGA (IC12.C18), MB_ZBT_memory (IC17.85)
IZBT_BW1: MB_main_FPGA (IC12.D16), MB_ZBT_memory (IC17.93)
IZBT_BW2: MB_main_FPGA (IC12.C16), MB_ZBT_memory (IC17.94)
IZBT_BW3: MB_main_FPGA (IC12.D15), MB_ZBT_memory (IC17.95)
IZBT_BW4: MB_main_FPGA (IC12.C15), MB_ZBT_memory (IC17.96)
IZBT_CEN: MB_main_FPGA (IC12.C17), MB_ZBT_memory (IC17.87)
IZBT_IO0: MB_main_FPGA (IC12.C25), MB_ZBT_memory (IC17.52)
IZBT_IO1: MB_main_FPGA (IC12.E24), MB_ZBT_memory (IC17.53)
IZBT_IO2: MB_main_FPGA (IC12.D24), MB_ZBT_memory (IC17.56)
IZBT_IO3: MB_main_FPGA (IC12.C24), MB_ZBT_memory (IC17.57)
IZBT_IO4: MB_main_FPGA (IC12.D23), MB_ZBT_memory (IC17.58)
IZBT_IO5: MB_main_FPGA (IC12.C23), MB_ZBT_memory (IC17.59)
IZBT_IO6: MB_main_FPGA (IC12.E22), MB_ZBT_memory (IC17.62)
IZBT_IO7: MB_main_FPGA (IC12.D22), MB_ZBT_memory (IC17.63)
IZBT_IO8: MB_main_FPGA (IC12.C22), MB_ZBT_memory (IC17.68)
IZBT_IO9: MB_main_FPGA (IC12.D21), MB_ZBT_memory (IC17.69)
IZBT_IO10: MB_main_FPGA (IC12.G15), MB_ZBT_memory (IC17.72)
IZBT_IO11: MB_main_FPGA (IC12.C21), MB_ZBT_memory (IC17.73)
IZBT_IO12: MB_main_FPGA (IC12.E21), MB_ZBT_memory (IC17.74)
IZBT_IO13: MB_main_FPGA (IC12.D20), MB_ZBT_memory (IC17.75)
IZBT_IO14: MB_main_FPGA (IC12.C20), MB_ZBT_memory (IC17.78)
IZBT_IO15: MB_main_FPGA (IC12.D19), MB_ZBT_memory (IC17.79)
IZBT_IO16: MB_main_FPGA (IC12.A17), MB_ZBT_memory (IC17.2)
IZBT_IO17: MB_main_FPGA (IC12.B18), MB_ZBT_memory (IC17.3)
IZBT_IO18: MB_main_FPGA (IC12.A18), MB_ZBT_memory (IC17.6)
IZBT_IO19: MB_main_FPGA (IC12.B19), MB_ZBT_memory (IC17.7)
IZBT_IO20: MB_main_FPGA (IC12.A19), MB_ZBT_memory (IC17.8)
IZBT_IO21: MB_main_FPGA (IC12.B21), MB_ZBT_memory (IC17.9)
IZBT_IO22: MB_main_FPGA (IC12.A21), MB_ZBT_memory (IC17.12)
IZBT_IO23: MB_main_FPGA (IC12.B22), MB_ZBT_memory (IC17.13)
IZBT_IO24: MB_main_FPGA (IC12.A22), MB_ZBT_memory (IC17.18)
IZBT_IO25: MB_main_FPGA (IC12.B23), MB_ZBT_memory (IC17.19)
IZBT_IO26: MB_main_FPGA (IC12.A23), MB_ZBT_memory (IC17.22)
IZBT_IO27: MB_main_FPGA (IC12.A25), MB_ZBT_memory (IC17.23)
IZBT_IO28: MB_main_FPGA (IC12.B26), MB_ZBT_memory (IC17.24)
IZBT_IO29: MB_main_FPGA (IC12.A26), MB_ZBT_memory (IC17.25)
IZBT_IO30: MB_main_FPGA (IC12.C27), MB_ZBT_memory (IC17.28)
IZBT_IO31: MB_main_FPGA (IC12.D28), MB_ZBT_memory (IC17.29)
IZBT_IOP1: MB_main_FPGA (IC12.D25), MB_ZBT_memory (IC17.51)
IZBT_IOP2: MB_main_FPGA (IC12.C19), MB_ZBT_memory (IC17.80)
IZBT_IOP3: MB_main_FPGA (IC12.B17), MB_ZBT_memory (IC17.1)
IZBT_IOP4: MB_main_FPGA (IC12.D27), MB_ZBT_memory (IC17.30)
IZBT_LBO: MB_main_FPGA (IC12.F27), MB_ZBT_memory (IC17.31)
IZBT_OE: MB_main_FPGA (IC12.D17), MB_ZBT_memory (IC17.86)
IZBT_RW: MB_main_FPGA (IC12.E17), MB_ZBT_memory (IC17.88)
JTAG_TCK: MB_main (CN5.17 R81.1 R82#1.2 R83#1.2), MB_fpga_power (IC12.P8)
JTAG_TDI: MB_main (R80#1.2 R95.1 R102.2), MB_fpga_power (IC12.P7)
JTAG_TMS: MB_main (CN5.19 R77.2 R78.1 R79.2), MB_fpga_power (IC12.P5)
MAIN_FPGA_DIN: MB_main (R71.1 R110.2), MB_main_FPGA (IC12.N7)
MAIN_FPGA_nCONF: MB_CPU_io_ports (IC5.G17), MB_fpga_power (R39.1)
MAIN_FPGA_nSTAT: MB_CPU_io_ports (IC5.E17), MB_fpga_power (IC12.M6 R40.2)
MAIN_nRST: MB_CPU_100m_ethernet (IC4.40), MB_CPU_io_ports (D22.2), MB_watchdog_mcu (IC9#2.J4 R80#2.2)
MCU_IO1: MB_watchdog_mcu (IC9#2.A1 RP20.8), MB_sensors (IC39.1 IC40.1 IC41.1 IC42.1)
MCU_IO2: MB_watchdog_mcu (IC9#2.B2 RP20.7), MB_sensors (IC39.6 IC40.6 IC41.6 IC42.6)
MCU_IO4: MB_main (CN4.5), MB_watchdog_mcu (IC9#2.J3)
MCU_IO29: MB_CPU_io_ports (IC5.K15), MB_watchdog_mcu (IC9#2.H7)
MCU_IO31: MB_main (CN2.41), MB_watchdog_mcu (IC9#2.B3)
NAND_RB: MB_CPU_io_ports (IC5.N3), MB_CPU_memory (IC11.7)
NetC32_1: MB_main (CN3.4 CN3.5), MB_CPU_100m_ethernet (5 pins)
NetCN3_1: MB_main (CN3.1), MB_CPU_100m_ethernet (IC4.7 R45.1)
NetCN3_2: MB_main (CN3.2), MB_CPU_100m_ethernet (IC4.8 R46.1)
NetCN3_3: MB_main (CN3.3), MB_CPU_100m_ethernet (IC4.3 R50.2)
NetCN3_6: MB_main (CN3.6), MB_CPU_100m_ethernet (IC4.4 R49.2)
NetCN3_10: MB_main (CN3.10), MB_CPU_100m_ethernet (R53.2)
NetCN3_11: MB_main (CN3.11), MB_CPU_100m_ethernet (R54.2)
NetIC3_3: MB_CPU_100m_ethernet (IC3.3 IC4.42), MB_CPU_io_ports (IC5.V13)
NetIC4_19: MB_CPU_100m_ethernet (IC4.19 RP1.3), MB_CPU_io_ports (IC5.V14)
NetIC4_20: MB_CPU_100m_ethernet (IC4.20 RP1.4), MB_CPU_io_ports (IC5.T13)
NetIC4_21: MB_CPU_100m_ethernet (IC4.21), MB_CPU_io_ports (IC5.P16)
NetIC4_24: MB_CPU_100m_ethernet (IC4.24), MB_CPU_io_ports (IC5.T15)
NetIC4_25: MB_CPU_100m_ethernet (IC4.25 R55.2), MB_CPU_io_ports (IC5.R16)
NetIC4_28: MB_CPU_100m_ethernet (IC4.28 RP1.2), MB_CPU_io_ports (IC5.R14)
NetIC4_29: MB_CPU_100m_ethernet (IC4.29 RP1.1), MB_CPU_io_ports (IC5.T14)
NetIC4_37: MB_CPU_100m_ethernet (IC4.37 R47.2), MB_CPU_io_ports (IC5.D11)
NetIC4_38: MB_CPU_100m_ethernet (IC4.38 R48.2), MB_CPU_io_ports (IC5.U14)
NetIC5_B2: MB_CPU_io_ports (IC5.B2), MB_CPU_memory (IC11.8)
NetIC5_B5: MB_CPU_io_ports (IC5.B5), MB_CPU_memory (IC7.39)
NetIC5_C3: MB_CPU_io_ports (IC5.C3), MB_CPU_memory (IC11.18)
NetIC5_E5: MB_CPU_io_ports (IC5.E5), MB_CPU_memory (IC6.39)
NetIC5_H3: MB_CPU_io_ports (IC5.H3), MB_CPU_memory (IC9#1.2 R65.2)
NetIC5_J17: MB_main (R70.2), MB_CPU_io_ports (IC5.J17)
NetIC5_J18: MB_main (R72.2), MB_CPU_io_ports (IC5.J18)
NetIC5_K16: MB_main (R69.2), MB_CPU_io_ports (IC5.K16)
NetIC5_K18: MB_main (R71.2), MB_CPU_io_ports (IC5.K18)
NetIC5_L13: MB_main (R73.2), MB_CPU_io_ports (IC5.L13)
NetIC5_M17: MB_CPU_io_ports (IC5.M17), MB_CPU_memory (IC8.2 R64.2)
NetIC5_N15: MB_CPU_io_ports (IC5.N15), MB_CPU_memory (IC10.13)
NetIC5_N16: MB_CPU_io_ports (IC5.N16), MB_CPU_memory (IC10.14)
NetIC5_P15: MB_main (R74.1), MB_CPU_io_ports (IC5.P15)
NetIC5_T16: MB_CPU_100m_ethernet (R52.1), MB_CPU_io_ports (IC5.T16)
NetIC10_12: MB_main (R74.2), MB_CPU_memory (IC10.12)
NetIC12_P6: MB_main (R68.1), MB_fpga_power (IC12.P6)
PC3: MB_main (R83#1.1), MB_CPU_io_ports (IC5.C15)
PC8: MB_main (R99.1), MB_CPU_io_ports (IC5.C14)
PC10: MB_main (R77.1), MB_CPU_io_ports (IC5.D15)
PC16: MB_main (R80#1.1), MB_CPU_io_ports (IC5.D14)
RAS: MB_CPU_io_ports (IC5.B4), MB_CPU_memory (IC6.18 IC7.18)
REFCLK_DP0: MB_clocking (R1.2), DP0 (IC23_DP0.14)
REFCLK_DP1: MB_clocking (R2.2), DP1 (IC23_DP1.14)
REFCLK_DP2: MB_clocking (R3.2), DP2 (IC23_DP2.14)
REFCLK_DP3: MB_clocking (R4.2), DP3 (IC23_DP3.14)
REFCLK_DP4: MB_clocking (R5.2), DP4 (IC23_DP4.14)
REFCLK_DP5: MB_clocking (R6.2), DP5 (IC23_DP5.14)
REFCLK_DP6: MB_clocking (R7.2), DP6 (IC23_DP6.14)
REFCLK_DP7: MB_clocking (R8.2), DP7 (IC23_DP7.14)
REFCLK_MAIN+: MB_main (CN11.3), MB_clocking (IC1.2 R10.1)
REFCLK_MAIN-: MB_main (CN11.5), MB_clocking (IC1.3 R10.2)
RS_CTS: MB_main (CN5.41), MB_CPU_io_ports (IC5.G6)
RS_RTS: MB_main (CN5.43), MB_CPU_io_ports (IC5.F1)
RS_RXD: MB_main (CN5.42), MB_CPU_io_ports (IC5.D10)
RS_TXD: MB_main (CN5.44), MB_CPU_io_ports (IC5.B10)
RX_N: MB_main (CN2.24), DP1 (C65_DP1.2)
RX_N: MB_main (CN2.33), DP3 (C65_DP3.2)
RX_N: MB_main (CN2.39), DP5 (C65_DP5.2)
RX_N: MB_main (CN2.135), DP7 (C65_DP7.2)
RX_N: MB_main (CN2.141), DP6 (C65_DP6.2)
RX_N: MB_main (CN2.147), DP4 (C65_DP4.2)
RX_N: MB_main (CN2.153), DP2 (C65_DP2.2)
RX_N: MB_main (CN2.159), DP0 (C65_DP0.2)
RX_P: MB_main (CN2.23), DP1 (C64_DP1.2)
RX_P: MB_main (CN2.32), DP3 (C64_DP3.2)
RX_P: MB_main (CN2.38), DP5 (C64_DP5.2)
RX_P: MB_main (CN2.136), DP7 (C64_DP7.2)
RX_P: MB_main (CN2.142), DP6 (C64_DP6.2)
RX_P: MB_main (CN2.148), DP4 (C64_DP4.2)
RX_P: MB_main (CN2.154), DP2 (C64_DP2.2)
RX_P: MB_main (CN2.160), DP0 (C64_DP0.2)
SDA10: MB_CPU_io_ports (IC5.E8), MB_CPU_memory (IC6.22 IC7.22)
SDCK: MB_CPU_io_ports (IC5.C5), MB_CPU_memory (IC6.38 IC7.38)
SDCKE: MB_CPU_io_ports (IC5.A2), MB_CPU_memory (IC6.37 IC7.37)
SDCS: MB_CPU_io_ports (IC5.A4), MB_CPU_memory (IC6.19 IC7.19)
SDWE: MB_CPU_io_ports (IC5.C4), MB_CPU_memory (IC6.16 IC7.16)
TX_N: MB_main (CN2.21), DP1 (C63_DP1.2)
TX_N: MB_main (CN2.30), DP3 (C63_DP3.2)
TX_N: MB_main (CN2.36), DP5 (C63_DP5.2)
TX_N: MB_main (CN2.138), DP7 (C63_DP7.2)
TX_N: MB_main (CN2.144), DP6 (C63_DP6.2)
TX_N: MB_main (CN2.150), DP4 (C63_DP4.2)
TX_N: MB_main (CN2.156), DP2 (C63_DP2.2)
TX_N: MB_main (CN2.162), DP0 (C63_DP0.2)
TX_P: MB_main (CN2.20), DP1 (C62_DP1.2)
TX_P: MB_main (CN2.29), DP3 (C62_DP3.2)
TX_P: MB_main (CN2.35), DP5 (C62_DP5.2)
TX_P: MB_main (CN2.139), DP7 (C62_DP7.2)
TX_P: MB_main (CN2.145), DP6 (C62_DP6.2)
TX_P: MB_main (CN2.151), DP4 (C62_DP4.2)
TX_P: MB_main (CN2.157), DP2 (C62_DP2.2)
TX_P: MB_main (CN2.163), DP0 (C62_DP0.2)
UP0_TD0: MB_main (CN11.15), MB_main_FPGA (RP11.1)
UP0_TD1: MB_main (CN11.17), MB_main_FPGA (RP11.2)
UP0_TD2: MB_main (CN11.19), MB_main_FPGA (RP11.3)
UP0_TD3: MB_main (CN11.21), MB_main_FPGA (RP11.4)
UP0_TD4: MB_main (CN11.23), MB_main_FPGA (RP13.1)
UP0_TD5: MB_main (CN11.27), MB_main_FPGA (RP13.2)
UP0_TD6: MB_main (CN11.29), MB_main_FPGA (RP13.3)
UP0_TD7: MB_main (CN11.31), MB_main_FPGA (RP13.4)
UP0_TD8: MB_main (CN11.33), MB_main_FPGA (RP16.2)
UP0_TD9: MB_main (CN11.35), MB_main_FPGA (RP16.1)
UP1_TD0: MB_main (CN11.18), MB_main_FPGA (RP12.4)
UP1_TD1: MB_main (CN11.20), MB_main_FPGA (RP12.3)
UP1_TD2: MB_main (CN11.22), MB_main_FPGA (RP12.2)
UP1_TD3: MB_main (CN11.24), MB_main_FPGA (RP12.1)
UP1_TD4: MB_main (CN11.26), MB_main_FPGA (RP14.4)
UP1_TD5: MB_main (CN11.30), MB_main_FPGA (RP14.3)
UP1_TD6: MB_main (CN11.32), MB_main_FPGA (RP14.2)
UP1_TD7: MB_main (CN11.34), MB_main_FPGA (RP14.1)
UP1_TD8: MB_main (CN11.36), MB_main_FPGA (RP17.2)
UP1_TD9: MB_main (CN11.38), MB_main_FPGA (RP17.1)
UP_ENABLE0: MB_main (CN11.43), MB_main_FPGA (RP10.5)
UP_ENABLE1: MB_main (CN11.42), MB_main_FPGA (RP15.7)
UP_LOOPEN0: MB_main (CN11.47), MB_main_FPGA (RP10.7)
UP_LOOPEN1: MB_main (CN11.48), MB_main_FPGA (RP15.5)
UP_PRBSEN0: MB_main (CN11.49), MB_main_FPGA (RP10.8)
UP_PRBSEN1: MB_main (CN11.41), MB_main_FPGA (RP15.8)
UP_SFP_SCL0: MB_main (CN5.38), MB_main_FPGA (RP26.6)
UP_SFP_SCL1: MB_main (CN5.24), MB_main_FPGA (RP27.6)
UP_SFP_SDA0: MB_main (CN5.36), MB_main_FPGA (RP26.7)
UP_SFP_SDA1: MB_main (CN5.22), MB_main_FPGA (RP27.7)
UP_SFP_TX_DISABLE0: MB_main (CN5.34), MB_main_FPGA (RP26.8)
UP_SFP_TX_DISABLE1: MB_main (CN5.20), MB_main_FPGA (RP27.8)
UP_SYNCEN0: MB_main (CN11.45), MB_main_FPGA (RP10.6)
UP_SYNCEN1: MB_main (CN11.46), MB_main_FPGA (RP15.6)
UTCA_GA0: MB_main (CN2.5), MB_watchdog_mcu (IC9#2.K6)
UTCA_GA1: MB_main (CN2.17), MB_watchdog_mcu (IC9#2.K7)
UTCA_GA2: MB_main (CN2.26), MB_watchdog_mcu (IC9#2.K8)
UTCA_PWRON#: MB_main (CN2.170), MB_watchdog_mcu (R82#2.1 R83#2.2 R91.2)
WD_CS: MB_CPU_io_ports (IC5.H14), MB_watchdog_mcu (RP18.4)
WD_MISO: MB_CPU_io_ports (IC5.H18), MB_watchdog_mcu (RP18.3)
WD_MOSI: MB_CPU_io_ports (IC5.H15), MB_watchdog_mcu (RP18.1)
WD_SCK: MB_CPU_io_ports (IC5.H17), MB_watchdog_mcu (RP18.2)
ZBT_CLK: MB_ZBT_memory (IC17.89), MB_clocking (R12.2)